# Altium schematic sheet USB Circuitry.SchDoc: USB Circuitry
size 431 x 279 mm; DrawnBy: DD; DocumentNumber: GHL-1-21002; Revision: B; SheetNumber: 3; SheetTotal: 7; ProjectID: 263-03
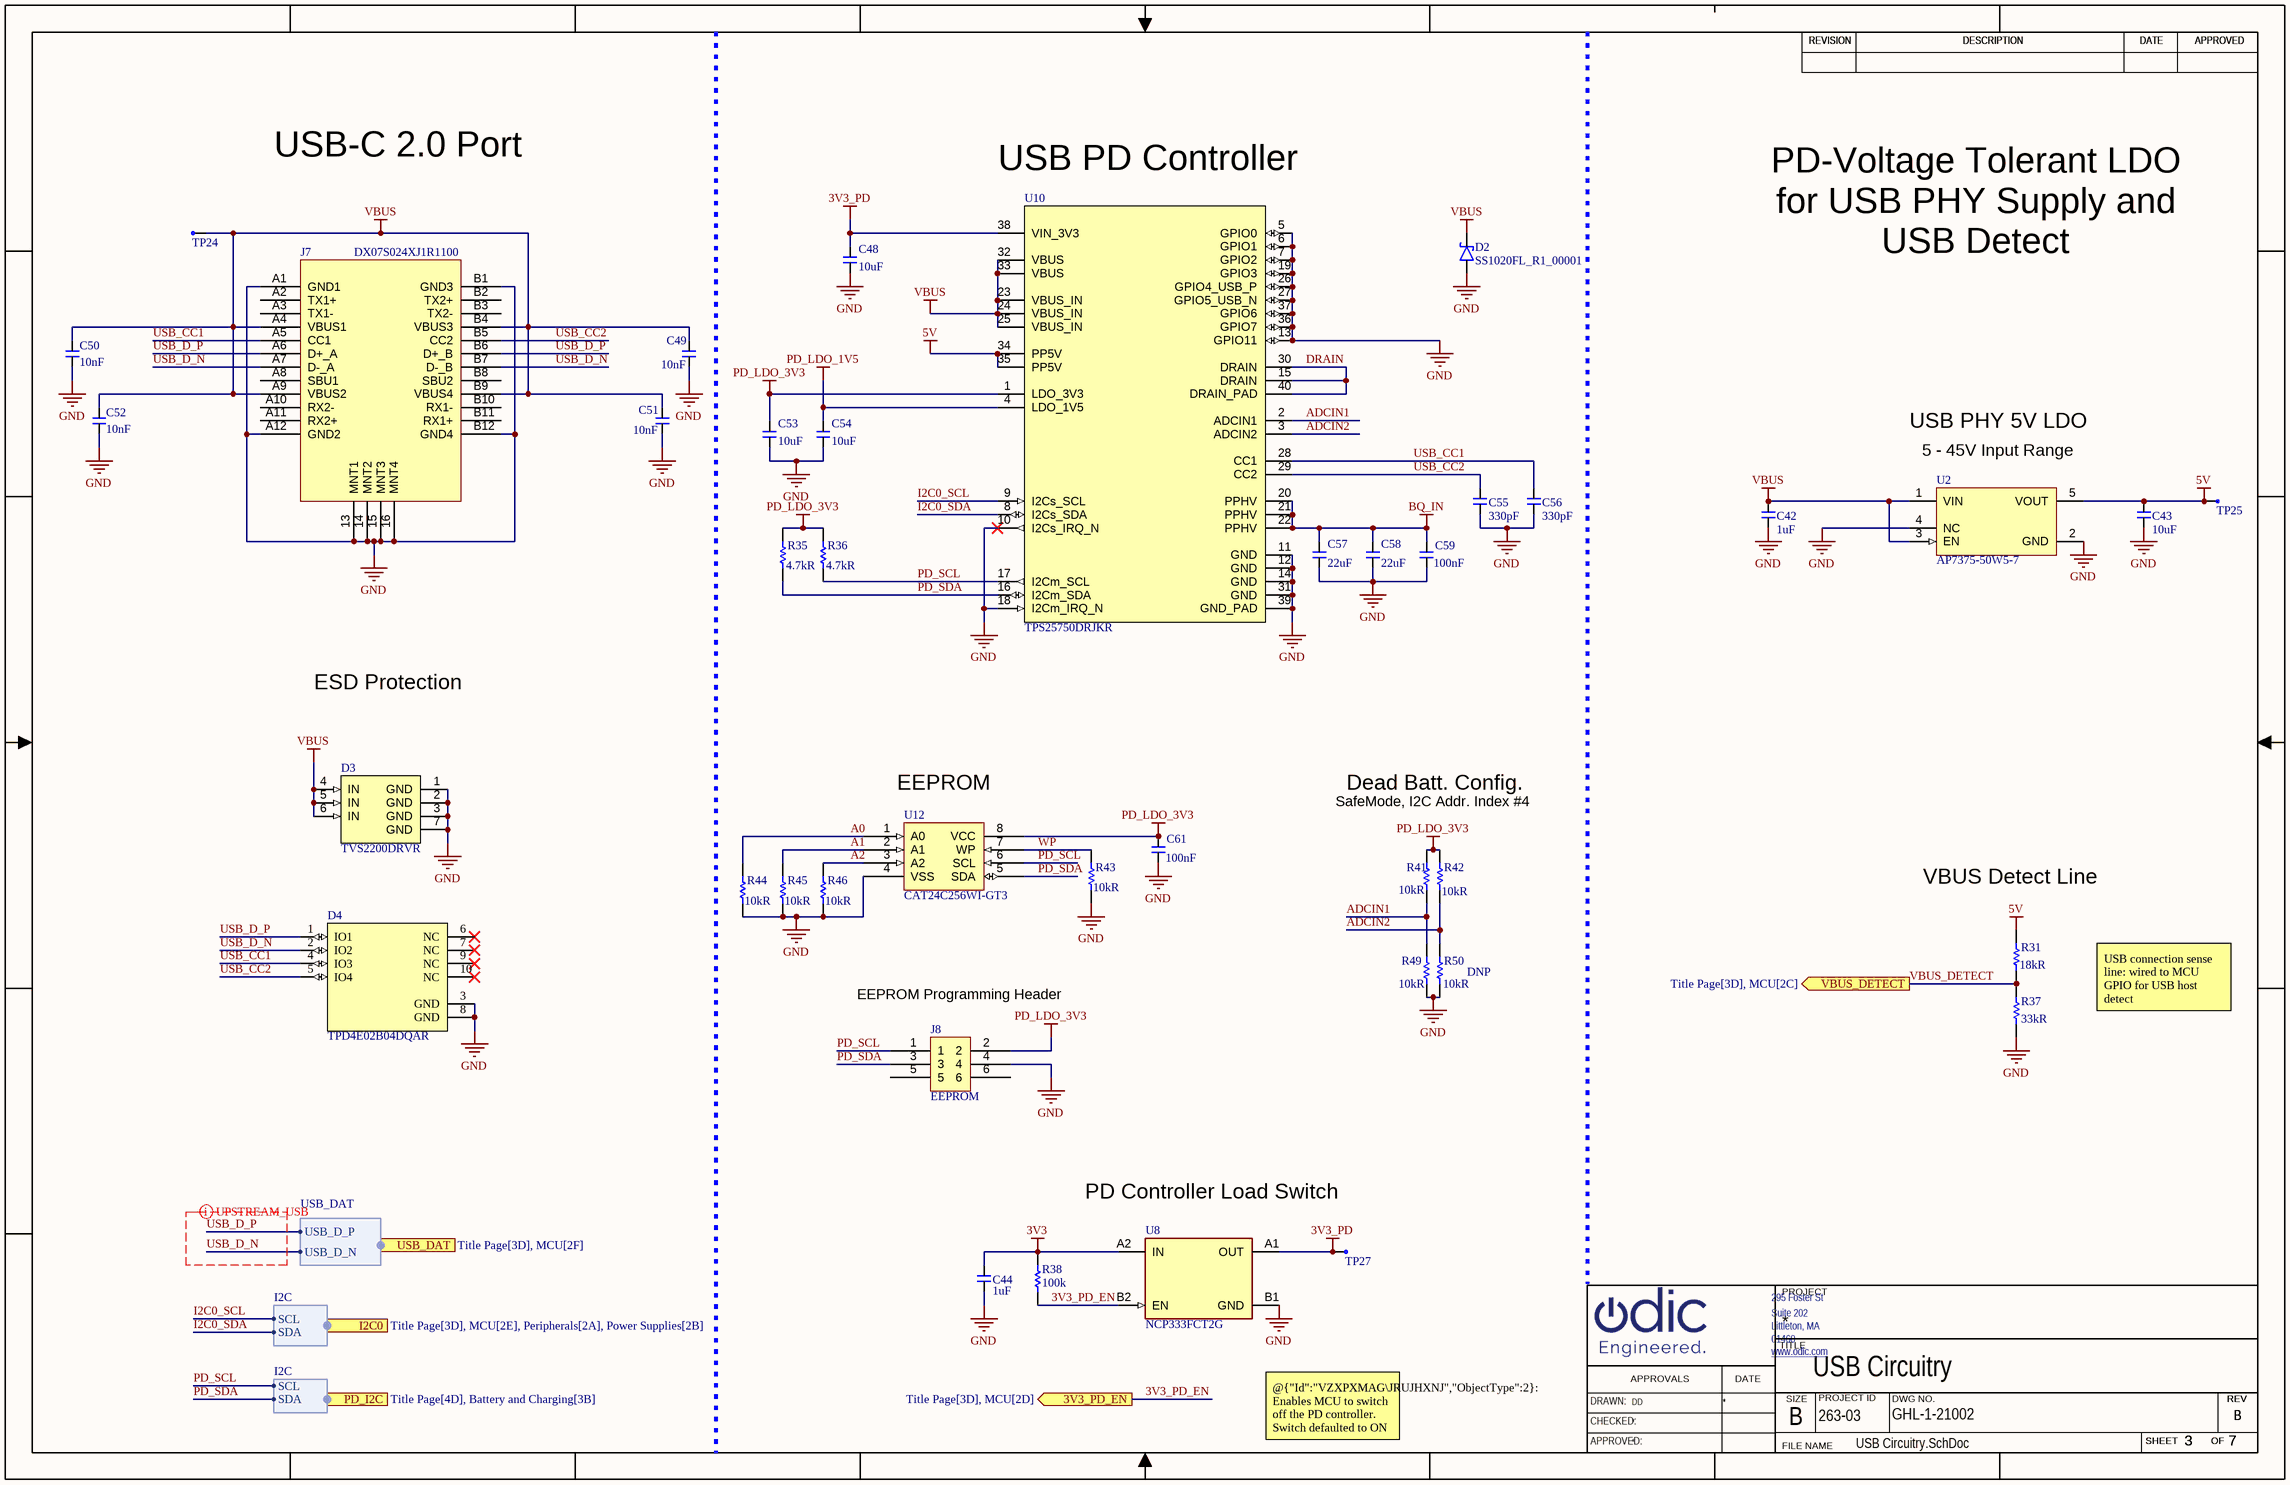
[diagram p0: USB Circuitry.SchDoc]

## Parts
C42  1uF  [C0603]
C43  10uF  [C0402]
C44  Capacitance: 1uF  [C0402]  (hidden comment: C0402_1u_6V3_10pct)
C48  Capacitance: 10uF  [C0402]  (hidden comment: C0402_10u_10V_20pct)
C49  value 10nF  [C0402]  (hidden comment: C0402_10n_35V_10pct)
C50  value 10nF  [C0402]  (hidden comment: C0402_10n_35V_10pct)
C51  value 10nF  [C0402]  (hidden comment: C0402_10n_35V_10pct)
C52  value 10nF  [C0402]  (hidden comment: C0402_10n_35V_10pct)
C53  Capacitance: 10uF  [C0402]  (hidden comment: C0402_10u_10V_20pct)
C54  Capacitance: 10uF  [C0402]  (hidden comment: C0402_10u_10V_20pct)
C55  value 330pF  [C0402]  (hidden comment: C0402_330p_50V_10pct)
C56  value 330pF  [C0402]  (hidden comment: C0402_330p_50V_10pct)
C57  Capacitance: 22uF  [c0805]  (hidden comment: C0805_22u_25V_20pct)
C58  Capacitance: 22uF  [c0805]  (hidden comment: C0805_22u_25V_20pct)
C59  Capacitance: 100nF  [C0402]  (hidden comment: C0402_0u1_25V_10pct)
C61  Capacitance: 100nF  [C0402]  (hidden comment: C0402_0u1_25V_10pct)
D2  SS1020FL_R1_00001  [sod-123fl_AK]
D3  TVS2200DRVR  [dfn7_2x2_p65mm]
D4  TPD4E02B04DQAR  [dfn10_1p1x2p6_p5mm]
J7  DX07S024XJ1R1100  [USB_JAE_DX07S024XJ1R1100]
J8  EEPROM  [tc2030-mcp-nl]
R31  value 18kR  [R0402]  (hidden comment: R0402_18k_1pct)
R35  Resistance: 4.7kR  [R0402]  (hidden comment: R0402_4k7_1pct)
R36  Resistance: 4.7kR  [R0402]  (hidden comment: R0402_4k7_1pct)
R37  Resistance: 33kR  [R0402]  (hidden comment: R0402_33k_1pct)
R38  100k  [R0402]
R41  Resistance: 10kR  [R0402]  (hidden comment: R0402_10k_1pct)
R42  Resistance: 10kR  [R0402]  (hidden comment: R0402_10k_1pct)
R43  Resistance: 10kR  [R0402]  (hidden comment: R0402_10k_1pct)
R44  Resistance: 10kR  [R0402]  (hidden comment: R0402_10k_1pct)
R45  Resistance: 10kR  [R0402]  (hidden comment: R0402_10k_1pct)
R46  Resistance: 10kR  [R0402]  (hidden comment: R0402_10k_1pct)
R49  Resistance: 10kR  [R0402]  (hidden comment: R0402_10k_1pct)
R50  Resistance: 10kR  Install: DNP  [R0402]  (hidden comment: R0402_10k_1pct)
TP24  TPC30  [tpc30]  (value not drawn)
TP25  TPC30  [tpc30]  (value not drawn)
TP27  TPC30  [tpc30]  (value not drawn)
U2  AP7375-50W5-7  [SOT25]
U8  NCP333FCT2G  [bga4_p743xp743_p4mm]
U10  TPS25750DRJKR  [qfn40_6x4_p4mm-RJK0038B]
U12  CAT24C256WI-GT3  [SO8]

## Ports
3V3_PD_EN (out, see Title Page[3D], MCU[2D]), I2C0 (harness I2C, see Title Page[3D], MCU[2E], Peripherals[2A], Power Supplies[2B]), PD_I2C (harness I2C, see Title Page[4D], Battery and Charging[3B]), USB_DAT (harness USB_DAT, see Title Page[3D], MCU[2F]), VBUS_DETECT (out, see Title Page[3D], MCU[2C])

## Harnesses
USB_DAT: USB_D_P, USB_D_N
I2C: SCL, SDA

## Nets
3V3: C44.2 R38.2 U8.A2(IN)
3V3_PD: C48.2 TP27.1 U8.A1(OUT) U10.38(VIN_3V3)
5V: C43.2 R31.2 TP25.1 U2.5(VOUT) U10.34(PP5V) U10.35(PP5V)
BQ_IN: C57.2 C58.2 C59.2 U10.20(PPHV) U10.21(PPHV) U10.22(PPHV)
GND: C42.1 C43.1 C44.1 C48.1 C49.1 C50.1 C51.1 C52.1 C53.1 C54.1 C55.1 C56.1 C57.1 C58.1 C59.1 C61.1 D2.A D3.1(GND) D3.2(GND) D3.3(GND) D3.7(GND) D4.3(GND) D4.8(GND) J7.13(MNT1) J7.14(MNT2) J7.15(MNT3) J7.16(MNT4) J7.A1(GND1) J7.A12(GND2) J7.B1(GND3) J7.B12(GND4) J8.4 R37.1 R43.1 R44.1 R45.1 R46.1 R49.1 R50.1 U2.2(GND) U2.4(NC) U8.B1(GND) U10.5(GPIO0) U10.6(GPIO1) U10.7(GPIO2) U10.10(I2Cs_IRQ_N) U10.11(GND) U10.12(GND) U10.13(GPIO11) U10.14(GND) U10.18(I2Cm_IRQ_N) U10.19(GPIO3) U10.26(GPIO4_USB_P) U10.27(GPIO5_USB_N) U10.31(GND) U10.36(GPIO7) U10.37(GPIO6) U10.39(GND_PAD) U12.4(VSS)
PD_LDO_1V5: C54.2 U10.4(LDO_1V5)
PD_LDO_3V3: C53.2 C61.2 J8.2 R35.2 R36.2 R41.2 R42.2 U10.1(LDO_3V3) U12.8(VCC)
VBUS: C42.2 C49.2 C50.2 C51.2 C52.2 D2.K D3.4(IN) D3.5(IN) D3.6(IN) J7.A4(VBUS1) J7.A9(VBUS2) J7.B4(VBUS3) J7.B9(VBUS4) TP24.1 U2.1(VIN) U2.3(EN) U10.23(VBUS_IN) U10.24(VBUS_IN) U10.25(VBUS_IN) U10.32(VBUS) U10.33(VBUS)
3V3_PD_EN: R38.1 U8.B2(EN) ; port 3V3_PD_EN
A0: R44.2 U12.1(A0)
A1: R45.2 U12.2(A1)
A2: R46.2 U12.3(A2)
ADCIN1: R41.1 R49.2 U10.2(ADCIN1)
ADCIN2: R42.1 R50.2 U10.3(ADCIN2)
DRAIN: U10.15(DRAIN) U10.30(DRAIN) U10.40(DRAIN_PAD)
I2C0_SCL: U10.9(I2Cs_SCL) ; port I2C0.SCL
I2C0_SDA: U10.8(I2Cs_SDA) ; port I2C0.SDA
PD_SCL: J8.1 R36.1 U10.17(I2Cm_SCL) U12.6(SCL) ; port PD_I2C.SCL
PD_SDA: J8.3 R35.1 U10.16(I2Cm_SDA) U12.5(SDA) ; port PD_I2C.SDA
USB_CC1: C56.2 D4.4(IO3) J7.A5(CC1) U10.28(CC1)
USB_CC2: C55.2 D4.5(IO4) J7.B5(CC2) U10.29(CC2)
USB_D_N: D4.2(IO2) J7.A7(D-_A) J7.B7(D-_B) ; port USB_DAT.USB_D_N
USB_D_P: D4.1(IO1) J7.A6(D+_A) J7.B6(D+_B) ; port USB_DAT.USB_D_P
VBUS_DETECT: R31.1 R37.2 ; port VBUS_DETECT
WP: R43.2 U12.7(WP)

Not connected (* = marked no-connect by the designer): D4 6(NC)* 7(NC)* 9(NC)* 10(NC)*; J7 A2(TX1+) A3(TX1-) A8(SBU1) A10(RX2-) A11(RX2+) B2(TX2+) B3(TX2-) B8(SBU2) B10(RX1-) B11(RX1+); J8 5 6

## Layout directives
differential pair: USB_D_N, USB_D_P

## Notes on the sheet
- USB-C 2.0 Port
- USB PD Controller
- PD-Voltage Tolerant LDO for USB PHY Supply and USB Detect
- USB PHY 5V LDO
- (near U2) 5 - 45V Input Range
- ESD Protection
- (near U12) EEPROM
- SafeMode, I2C Addr. Index #4
- Dead Batt. Config.
- VBUS Detect Line
- (near J8) EEPROM Programming Header
- USB connection sense line: wired to MCU GPIO for USB host detect
- PD Controller Load Switch
- @{"Id":"VZXPXMAG\JRUJHXNJ","ObjectType":2}: Enables MCU to switch off the PD controller. Switch defaulted to ON
- REVISION
- DESCRIPTION
- DATE
- APPROVED
- 295 Foster St
- PROJECT
- www.odic.com <http://www.odic.com>
- Littleton, MA
- 01460
- Suite 202
- TITLE
- DRAWN:
- CHECKED:
- APPROVALS
- SIZE
- B
- PROJECT ID
- DWG NO.
- SHEET
- OF
- REV
- APPROVED:
- FILE NAME

## Library data of the parts
C42 = CMP-001-00011-1: Multilayer Ceramic Capacitors MLCC - SMD/SMT 1uF 50V 0603 RoHS; Tolerance: 10%; Install: POP; Dielectric: X5R; Max Operating Temperature: 85°C; Packaging: Tape and Reel; Termination: SMD/SMT; Width: 0.031inch; Voltage Rating (DC): 50V; Length: 0.063inch; Halogen Free: Halogen Free; Case/Package: 0603; Package Quantity: 4000; Lead Free: Lead Free; Voltage Rating: 50V; Resistor Type: Ceramic; Value: 1uF; Thickness: 0.035inch; Weight: 7.1E-05oz; Min Operating Temperature: -55°C; Case Code (Metric): 1608; Case Code (Imperial): 0603; Mounting Technology: Surface Mount; RoHS Compliant: Yes; Series: CC
C43 C48 C53 C54 = CMP-00507-2: Ceramic capacitor SMD; 0402; 10uF; 10V; X5R; 20%; Install: POP; Dielectric: X5R; Tolerance: 20%; Voltage Rating: 10V; Case Code (Imperial): 0402
  C43: Capacitance: 10uF
C44 = CMP-00342-1: Cap Ceramic 1uF 6.3V X5R 10% SMD 0402 85C Paper T/R; Install: POP; Max Operating Temperature: 85°C; RoHS Compliant: Yes; Number of Pins: 2; Packaging: Tape and Reel; Thickness: 0.022inch; Lead Free: Lead Free; Package Quantity: 10000; Tolerance: 10%; Height: 0.5mm; Depth: 0.5mm; Construction: Flat; Radiation Hardening: No; REACH SVHC: No SVHC; Dielectric: X5R; Resistor Type: Ceramic; Min Operating Temperature: -55°C; Series: M; Width: 0.5mm; Case/Package: 0402; Voltage Rating: 6.3V; Case Code (Imperial): 0402; Length: 1mm; Voltage Rating (DC): 6.3V; Halogen Free: Halogen Free; Termination: SMD/SMT; Mount: Surface Mount; Case Code (Metric): 1005
C49-C52 = CMP-00724-2: Multilayer Ceramic Capacitor, 0.01 uF, 35 V, ± 10%, X7R, 0402 [1005 Metric]; Voltage Rating (DC): 35V; Install: POP; Packaging: Tape and Reel; Voltage Rating: 35V; Height: 0.5mm; Package Quantity: 1; Max Operating Temperature: 125°C; Length: 1mm; Width: 0.02inch; RoHS Compliant: Yes; Case/Package: 0402; Weight: 2.3E-05oz; Thickness: 0.022inch; Reach SVHC Compliant: No; Tolerance: 10%; Min Operating Temperature: -55°C; Mounting Technology: Surface Mount; Termination: SMD/SMT; Case Code (Metric): 1005; Dielectric: X7R; Series: CGA; Case Code (Imperial): 0402; Depth: 0.5mm; Ratings: AEC-Q200
C55 C56 = CMP-00652-2: 0402 330 pF 50 V ±5% Tolerance C0G SMT Multilayer Ceramic Capacitor; Insulation Resistance: 10GR; Voltage: 50V; Temperature Coefficient: 30ppm/°C; Install: POP; Material: Ceramic; Depth: 0.5mm; Termination: SMD/SMT; Dielectric: C0G; Packaging: Tape and Reel; Case/Package: 0402; Height: 0.5mm; Length: 1mm; Lead Free: Lead Free; RoHS Compliant: Yes; Thickness: 0.022inch; Case Code (Metric): 1005; Case Code (Imperial): 0402; Width: 0.5mm; Size: 0.5mm; Radiation Hardening: No; Pins: 2; Voltage Rating: 50V; Reach SVHC Compliant: No; Mounting Technology: Surface Mount; Tolerance: 5%; Min Operating Temperature: -55°C; Voltage Rating (DC): 50V; Construction: Flat; Package Quantity: 1; Max Operating Temperature: 125°C; Series: GRM
C57 C58 = CMP-00654-4: Multilayer Ceramic Capacitor, 22 uF, 25 V, ± 20%, X5R, 0805 [2012 Metric]; Install: POP; RoHS Compliant: Yes
C59 C61 = CMP-00369-1: Cap Ceramic 0.1uF 25V X5R 10% Pad SMD 0402 Multi Layer Ceramic Capacitor (MLCC); Install: POP; Packaging: Tape and Reel; Construction: Flat; Max Operating Temperature: 85°C; Case Code (Metric): 1005; Voltage Rating (DC): 25V; Min Operating Temperature: -55°C; Height: 0.5mm; Series: CL; Case/Package: 0402; Voltage: 25V; Package Quantity: 1; Radiation Hardening: No; Depth: 0.5mm; Thickness: 0.022inch; Lead Free: Lead Free; Tolerance: 10%; Length: 1mm; Mount: Surface Mount; Width: 0.02inch; Dielectric: X5R; RoHS Compliant: Yes; Voltage Rating: 25V; Case Code (Imperial): 0402
D2 = CMP-00259-3: Diode Schottky 20V 1A 2-Pin SOD-123FL T/R; Peak Non-Repetitive Surge Current: 40A; Element Configuration: Single; Max Reverse Current: 500uA; Install: POP; Radiation Hardening: No; Max Repetitive Reverse Voltage (Vrrm): 20V; Mount: Surface Mount; RoHS Compliant: Yes; Min Operating Temperature: -55°C; Max Operating Temperature: 125°C; Number of Pins: 2
D3 = CMP-00678-2: 22-V flat-clamp surge protection device 6-WSON -40 to 125; Clamping Voltage: 28V; Install: POP; Number of Channels: 1; RoHS Compliant: Yes; Series: -; Number of Circuits: 1; Max Operating Temperature: 125°C; Mounting Technology: Surface Mount; Min Operating Temperature: -40°C; Packaging: Cut Tape
D4 = CMP-00677-2: Quad 0.25-pF, ±3.6-V, ±12-kV ESD protection diode for USB 3.0, HDMI 2.0 & High Speed Signals; Power Line Protection: No; Number of Channels: 4; Diode Type: ZENER; Install: POP; Peak Pulse Power: 17W; Reverse Standoff Voltage: 3.6V; Interface: USB,HDMI; Peak Pulse Current: 5A; Min Breakdown Voltage: 5.5V; Pins: 10; Min Operating Temperature: -40°C; Max Operating Temperature: 125°C; Series: -; Packaging: Cut Tape; RoHS Compliant: Yes; Mounting Technology: Surface Mount; Reach SVHC Compliant: No; Number of Bidirectional Channels: 4; Operating Supply Voltage: 3.6V; Lead Free: Lead Free
J7 = CMP-00680-3: USB C Connector, 24 Contact(s), Female, Right Angle, Solder and Surface Mount Terminal, Locking, Receptacle; Mating Cycles: 10000; Number of Ports: 1; Voltage Rating: 20V; Number of Contacts: 24; Shielding: Shielded; Install: POP; Max Operating Temperature: 80°C; Min Operating Temperature: -30°C; Insulation Color: Black; Contact Plating: Gold; Termination: Solder; Connector Type: USB; RoHS Compliant: Yes; Series: DX07; Gender: Receptacle; Mounting Technology: Surface Mount,Through Hole,Horizontal; Packaging: Cut Tape
J8 = CMP-00144-9: 6 Pin Tag-Connect Header Footprint. Pads.; Install: DNP
R31 = CMP-00742-2: SMD Chip Resistor, 18 kOhm, ± 1%, 63 mW, 0402 [1005 Metric], Thick Film, General Purpose; Voltage Rating (AC): 50V; Temperature Coefficient: 100ppm/°C; Max Power Dissipation: 63mW; Install: POP; RoHS Compliant: Yes; Height: 0.016inch; Min Operating Temperature: -55°C; Series: RC; Case Code (Imperial): 0402; Termination: SMD/SMT; Length: 1mm; Features: Moisture Resistant; Reach SVHC Compliant: Unknown; Lead Free: Lead Free; Number of Terminations: 2; Depth: 0.5mm; Resistor Type: Thick Film; Resistance Tolerance: 1%; Max Operating Temperature: 155°C; Case Code (Metric): 1005; Military Standard: Not; Power Rating: 63mW; Package Quantity: 1; Tolerance: 1%; Voltage Rating: 50V; Construction: Rectangular; Technology: THICK FILM; Width: 0.02inch; Case/Package: 0402; Packaging: Tape and Reel
R35 R36 = CMP-00336-2: RES 4.7K OHM 1% 1/16W 0402; Install: POP; Temperature Coefficient: 100ppm/°C; Voltage Rating: 50V; Max Power Dissipation: 63mW; Power Rating: 62.5mW; Features: Moisture Resistant; Length: 1mm; REACH SVHC: No SVHC; RoHS Compliant: Yes; Military Standard: Not; Size Code: 0402; Series: RC; Width: 0.5mm; Lead Free: Lead Free; Max Operating Temperature: 155°C; Height: 0.32mm; Voltage Rating (DC): 50V; Construction: Rectangular; Packaging: Tape and Reel; Tolerance: 1%; Case Code (Metric): 1005; Case Code (Imperial): 0402; Number of Pins: 2; Resistor Type: Thick Film; Number of Terminations: 2; Termination: SMD/SMT; Min Operating Temperature: -55°C; Case/Package: 0402; Height - Seated (Max): 0.016inch; Resistance Tolerance: 1%; Depth: 0.5mm
R37 = CMP-00309-1: Res Thick Film 0402 33K Ohm 1% 0.063W(1/16W) ±100ppm/C Pad SMD T/R; Voltage Rating (DC): 50V; Temperature Coefficient: 100ppm/°C; Power Rating: 63mW; Install: POP; Tolerance: 1%; Case/Package: 0402; RoHS Compliant: Yes; Lead Free: Lead Free; Package Quantity: 1; Weight: 2.3E-05oz; Termination: SMD/SMT; Depth: 0.5mm; Number of Pins: 2; Min Operating Temperature: -55°C; Construction: Rectangular; Number of Terminations: 2; Packaging: Tape and Reel; Case Code (Metric): 1005; Resistor Type: Thick Film; Height: 0.016inch; Series: RC; REACH SVHC: No SVHC; Features: Moisture Resistant; Size Code: 0402; Military Standard: Not; Width: 0.5mm; Voltage Rating: 50V; Case Code (Imperial): 0402; Max Power Dissipation: 63mW; Length: 1mm; Max Operating Temperature: 155°C; Resistance Tolerance: 1%
R38 = CMP-00351-1: Res General Purpose Thick Film 0402 100K Ohm 1% 1/16W ±100ppm/°C Molded SMD Paper T/R; Working Voltage: 50V; Resistance: 100kR; Install: POP; Power Rating: 63mW; Series: RC; Military Standard: Not; Case Code (Metric): 1005; Features: Moisture Resistant; Termination: SMD/SMT; Number of Terminations: 2; Temperature Coefficient: 100ppm/°C; Height: 0.016inch; Tolerance: 1%; Case/Package: 0402; Depth: 0.5mm; RoHS Compliant: Yes; Resistance Tolerance: 1%; Lead Free: Lead Free; Max Operating Temperature: 155°C; Min Operating Temperature: -55°C; Width: 0.02inch; Packaging: Tape and Reel; Technology: THICK FILM; Case Code (Imperial): 0402; Package Quantity: 1; REACH SVHC: No SVHC; Resistor Type: Thick Film; Max Power Dissipation: 63mW; Voltage Rating: 50V; Length: 0.039inch; Construction: Rectangular
R41-R46 R49 = CMP-00352-1: Res Thick Film 0402 10K Ohm 1% 1/16W ±100ppm/°C Molded SMD SMD T/R; Max Power Dissipation: 63mW; Install: POP; RoHS Compliant: Yes; Number of Terminations: 2; Case/Package: 0402; Case Code (Metric): 1005; Length: 0.039inch; Military Standard: Not; Size Code: 0402; Series: RC; Height: 0.016inch; Contact Plating: Tin; Features: Moisture Resistant; Width: 0.02inch; Mount: Surface Mount; Temperature Coefficient: 100ppm/°C; Package Quantity: 1; Resistor Type: Thick Film; Min Operating Temperature: -55°C; Max Operating Temperature: 155°C; Power Rating: 63mW; Tolerance: 1%; Depth: 0.5mm; Case Code (Imperial): 0402; Construction: Rectangular; Packaging: Tape and Reel; Radiation Hardening: No
R50 = CMP-00352-1: Res Thick Film 0402 10K Ohm 1% 1/16W ±100ppm/°C Molded SMD SMD T/R; Max Power Dissipation: 63mW; RoHS Compliant: Yes; Number of Terminations: 2; Case/Package: 0402; Case Code (Metric): 1005; Length: 0.039inch; Military Standard: Not; Size Code: 0402; Series: RC; Height: 0.016inch; Contact Plating: Tin; Features: Moisture Resistant; Width: 0.02inch; Mount: Surface Mount; Temperature Coefficient: 100ppm/°C; Package Quantity: 1; Resistor Type: Thick Film; Min Operating Temperature: -55°C; Max Operating Temperature: 155°C; Power Rating: 63mW; Tolerance: 1%; Depth: 0.5mm; Case Code (Imperial): 0402; Construction: Rectangular; Packaging: Tape and Reel; Radiation Hardening: No
TP24 TP25 TP27 = CMP-00021-4: Test Point Circle 30; Install: DNP
U2 = CMP-058-000001-1: Fixed 5V LDO Voltage Regulators LDO CMOS LowCurr SOT23 TR 3K; Install: POP; Output Voltage: 5V
U8 = CMP-00215-5: IC LOAD SWITCH W/DIS 1.5A 4WLCSP; On-State Resistance: 400mR; Turn-On Delay Time: 195us; Install: POP; Power Dissipation: 400mW; Number of Outputs: 1; Output Configuration: High Side; Operating Supply Voltage: 5.5V; Interface: On/Off; Packaging: Tape and Reel; Max Supply Current: 1.5A; Number of Pins: 4; Package Quantity: 3000; Max Operating Temperature: 85°C; RoHS Compliant: Yes; Min Operating Temperature: -40°C; Lead Free: Lead Free; Output Current: 1.5A; Max Power Dissipation: 400mW; Mount: Surface Mount; Series: -; Max Output Current: 1.5A; Halogen Free: Halogen Free
U10 = CMP-00653-4: Highly integrated USB Type-C® and USB PD controller with pre-configured GUI 38-WQFN -40 to 125; Install: POP
U12 = CMP-00660-3: IC EEPROM 256KBIT 400KHZ 8SOIC; Supply Current: 3mA; Operating Supply Voltage: 5V; Density: 256Kb; Write Protection: YES; Access Time: 500ns; Nominal Supply Voltage: 5.5V; Organization: 32KX8; Memory Format: Non-Volatile,EEPROM; Interface: I2C,Serial; Memory Size: 32000; Min Supply Voltage: 1.8V; Write Cycle Time-Max (tWC): 5ms; Access Time-Max: 900ns; Frequency: 1MHz; Install: POP; Lead Free: Lead Free; Reach SVHC Compliant: No; Packaging: Tape and Reel; Mounting Technology: Surface Mount; Case/Package: SOIC; Max Operating Temperature: 85°C; Height: 1.5mm; Pins: 8; Length: 5mm; Max Supply Voltage: 5.5V; Halogen Free: Halogen Free; RoHS Compliant: Yes; Series: -; Radiation Hardening: No; Width: 4mm; Clock Frequency: 400kHz; Min Operating Temperature: -40°C